# EAGLE design PCB_DIY_SQM_Test_RAW (EAGLE 6.2)
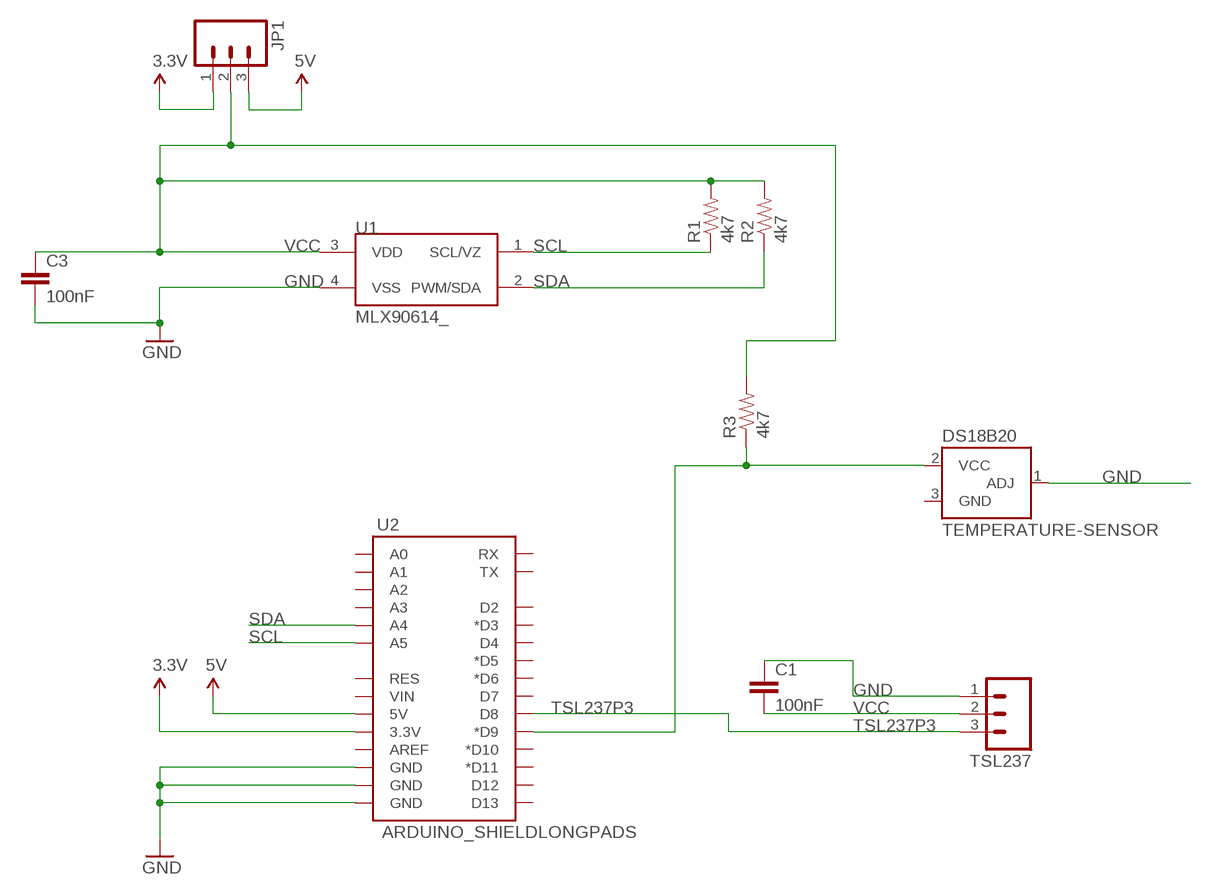
[diagram p0: schematic, sheet 1]

## Parts
C1  100nF  CAPPTH  [CAP-PTH-SMALL]
C3  100nF  CAPPTH  [CAP-PTH-SMALL]
DS18B20  TEMPERATURE-SENSOR  [TO-92]
JP1  M03LOCK_LONGPADS  [1X03_LOCK_LONGPADS]
R1  4k7  RESISTORPTH-1/4W  [AXIAL-0.4]
R2  4k7  RESISTORPTH-1/4W  [AXIAL-0.4]
R3  4k7  RESISTORPTH-1/4W  [AXIAL-0.4]
TSL237  M03LOCK_LONGPADS  [1X03_LOCK_LONGPADS]
U1  MLX90614_  [TO-39]
U2  ARDUINO_SHIELDLONGPADS  [DUEMILANOVE_SHIELD_LONGPADS]

## Nets
3.3V: JP1.1 U2.3.3V
5V: JP1.3 U2.5V
DS18B20P2: DS18B20.2(VCC) R3.P$1 U2.D9(*D9)
GND: C1.1 C3.2 DS18B20.1(ADJ) TSL237.1 U1.4(VSS) U2.GND@0(GND) U2.GND@1(GND) U2.GND@2(GND)
SCL: R1.P$1 U1.1(SCL/VZ) U2.A5
SDA: R2.P$1 U1.2(PWM/SDA) U2.A4
TSL237P3: TSL237.3 U2.D8
VCC: C1.2 C3.1 JP1.2 R1.P$2 R2.P$2 R3.P$2 TSL237.2 U1.3(VDD)
Unconnected: DS18B20.3(GND) U2.A0 U2.A1 U2.A2 U2.A3 U2.AREF U2.D2 U2.D3(*D3) U2.D4 U2.D5(*D5) U2.D6(*D6) U2.D7 U2.D10(*D10) U2.D11(*D11) U2.D12 U2.D13 U2.RES U2.RX U2.TX U2.VIN

## Library data of the parts
C1 C3 = SparkFun-Passives:CAP: Capacitor Standard 0603 ceramic capacitor, and 0.1" leaded capacitor.
DS18B20 = SparkFun-Sensors:TEMPERATURE-SENSOR: TO-92 temp sensor
JP1 TSL237 = SparkFun-Connectors:M03: Header 3 Standard 3-pin 0.1" header. Use with straight break away headers (SKU : PRT-00116), right angle break away headers (PRT-00553), swiss pins (PRT-00743), machine pins (PRT-00117), and female headers (PRT-00115). Molex polarized connector foot print use with SKU : PRT-08232 with associated crimp pins and housings.
R1-R3 = SparkFun-Passives:RESISTOR: Resistor Basic schematic elements and footprints for 0603, 1206, and PTH resistors.
U1 = SparkFun-Sensors:MLX90614: Non-contact PIR I2C interface temperature sensor
U2 = SparkFun-Boards:ARDUINO_SHIELD: Arduino shield footprint

## Board
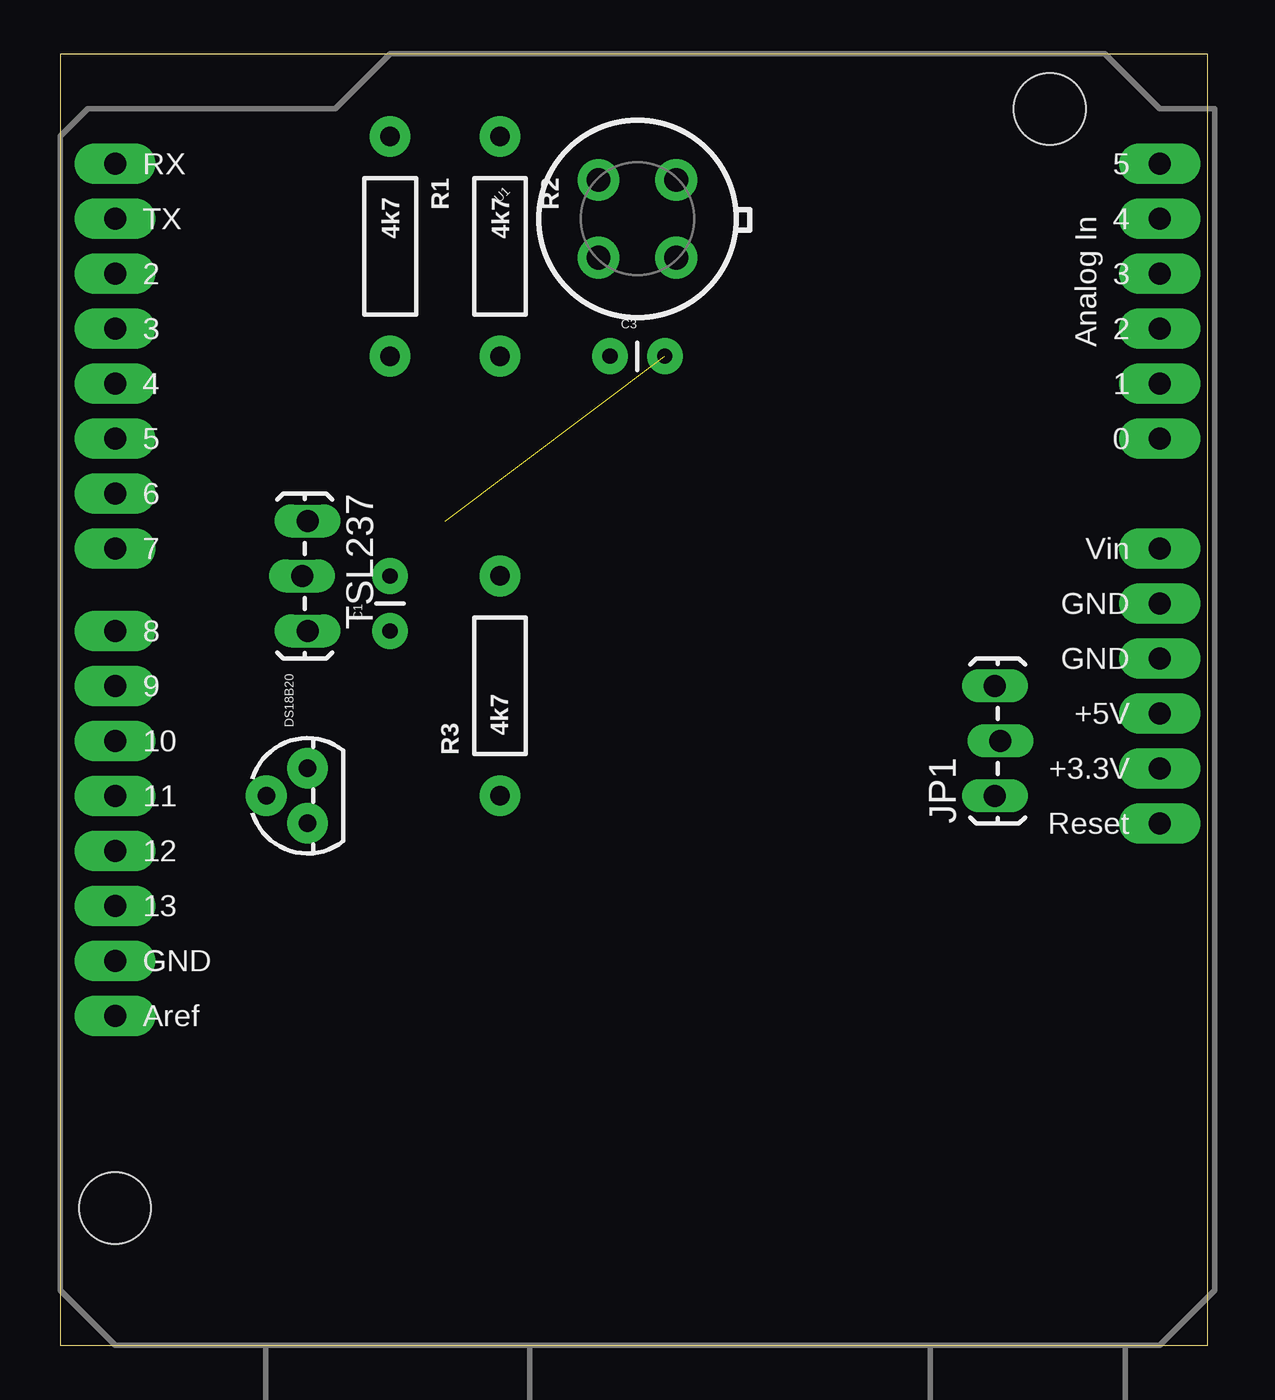
[diagram p1: board, top side]
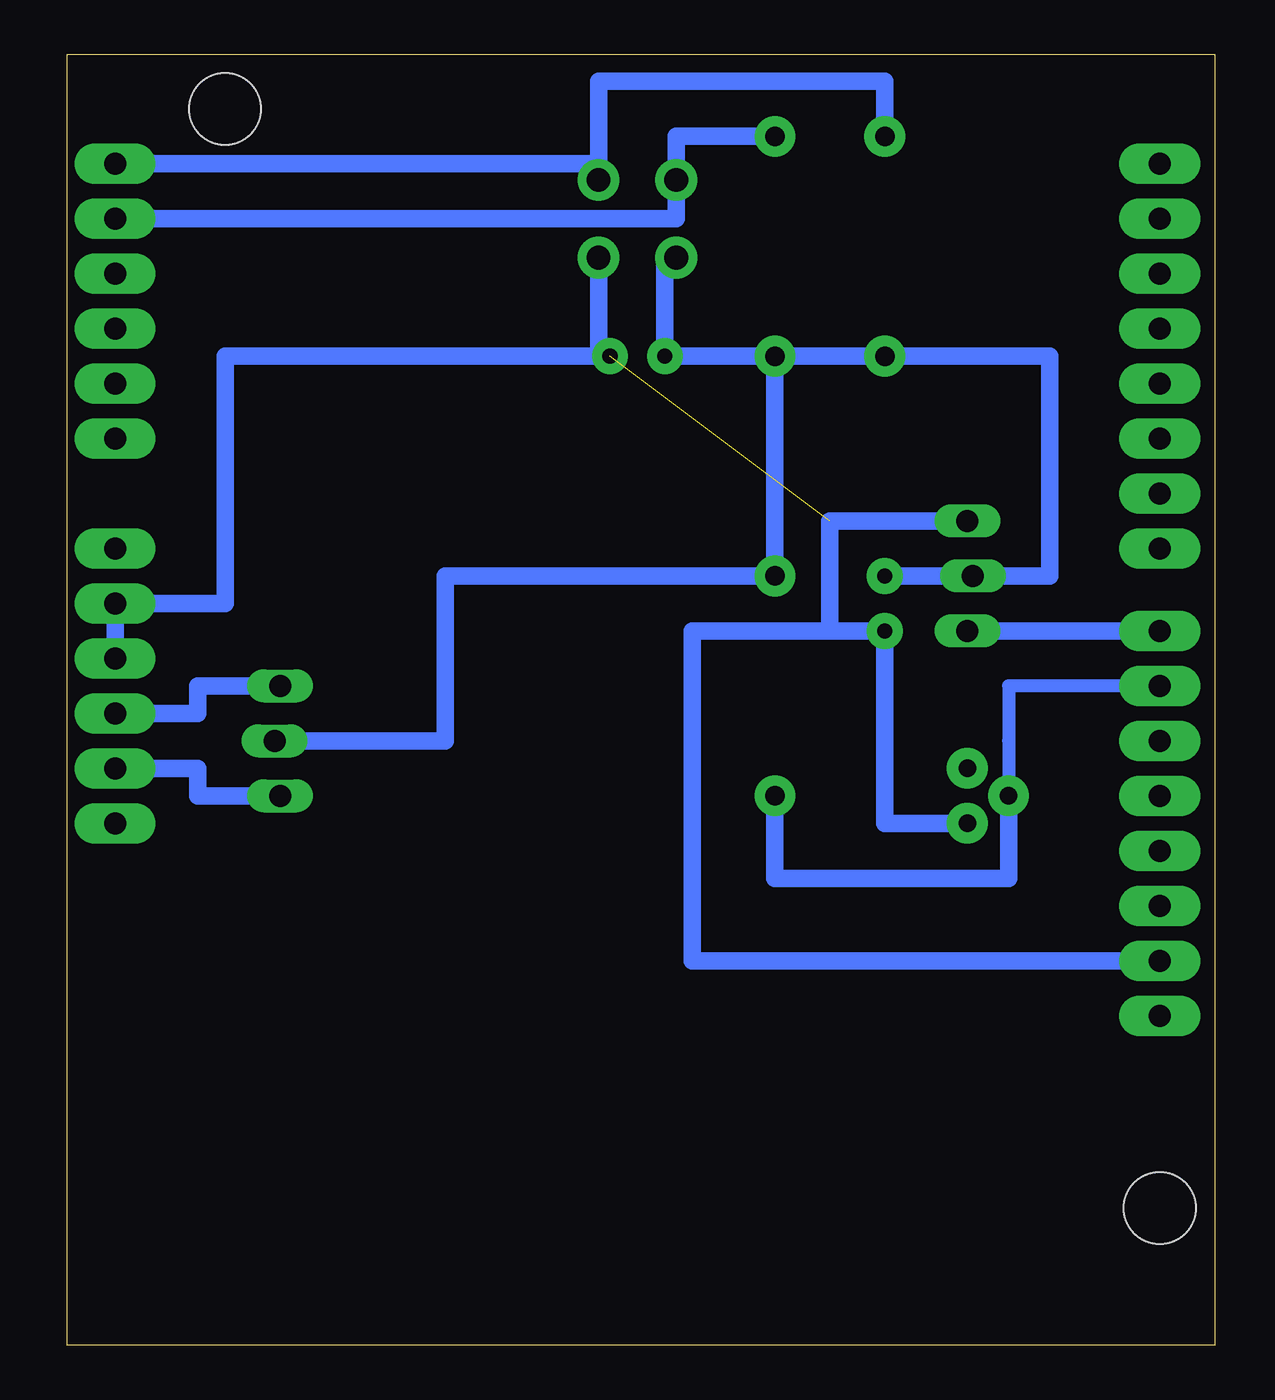
[diagram p2: board, bottom side, seen from below]

Size 53.01 x 59.68 mm. Coordinates in mm from the lower left corner, seen from the top.
Outline: 0,0 53.01,0 53.01,59.68 0,59.68 0,0
Copper layers (1*16): Top 0.035mm / dielectric 1.5mm / Bottom 0.035mm
Design rules: minimum track width 10mil, minimum drill 24mil, track to track 8mil, track to pad 8mil, pad to pad 8mil, via to via 8mil, smd to smd 8mil, copper to edge 40mil, drill to drill 8mil, minimum pad ring 10mil, minimum via ring 8mil, stop-mask expansion 4mil, vias tented up to drill 0mil, thermal gap 10mil

### Footprints (pad centres in the part's own frame; a part is rotated, then mirrored left to right if it is on the bottom)
CAP-PTH-SMALL = drill 0.7 pad 1.651: 1 0,0; 2 2.54,0
TO-92 = drill 0.813 pad 1.88: 1 -1.27,0; 2 0,1.905; 3 1.27,0
1X03_LOCK_LONGPADS = drill 1.016 long: 1 0,0; 2 2.54,-0.254; 3 5.08,0
AXIAL-0.4 = drill 0.9 pad 1.88: P$1 -5.08,0; P$2 5.08,0
TO-39 = drill 1.1 pad 1.93: 1 2.54,0; 2 0,2.54; 3 -2.54,0; 4 0,-2.54
DUEMILANOVE_SHIELD_LONGPADS = drill 1.016 pad 1.88 long: 3.3V 50.8,26.67; 5V 50.8,29.21; A0 50.8,41.91; A1 50.8,44.45; A2 50.8,46.99; A3 50.8,49.53; A4 50.8,52.07; A5 50.8,54.61; AREF 2.54,15.24; D2 2.54,49.53; D3 2.54,46.99; D4 2.54,44.45; D5 2.54,41.91; D6 2.54,39.37; D7 2.54,36.83; D8 2.54,33.02; D9 2.54,30.48; D10 2.54,27.94; D11 2.54,25.4; D12 2.54,22.86; D13 2.54,20.32; GND@0 50.8,31.75; GND@1 50.8,34.29; GND@2 2.54,17.78; RES 50.8,24.13; RX 2.54,54.61; TX 2.54,52.07; VIN 50.8,36.83 | hole 3.302: 45.72,57.15; 2.54,6.35

### Placement (x,y rotation side)
C1  15.24,33.02 90 top
C3  25.4,45.72 0 top
DS18B20  11.43,25.4 90 top
JP1  43.18,25.4 90 top
R1  15.24,50.8 270 top
R2  20.32,50.8 270 top
R3  20.32,30.48 90 top
TSL237  11.43,38.1 270 top
U1  26.67,52.07 45 top
U2  0,0 0 top

### Tracks (layer width: path | path; a pad name or v marks a point on that pad's centre or on a via)
3.3V
  Bottom 0.813: U2.3.3V 46.99,26.67 46.99,25.4 JP1.1
5V
  Bottom 0.813: U2.5V 46.99,29.21 46.99,30.48 JP1.3
DS18B20P2
  Bottom 0.61: 9.53,27.94 DS18B20.2 9.53,30.48 U2.D9
  Bottom 0.813: R3.P$1 20.32,21.59 9.53,21.59 DS18B20.2
GND  (1 unrouted)
  Bottom 0.813: U1.4 28.47,45.72 C3.2 45.72,45.72 45.72,34.29 U2.GND@1 U2.GND@0 | DS18B20.1 15.24,24.13 C1.1 17.78,33.02 | TSL237.1 17.78,38.1 17.78,33.02 | U2.GND@2 24.13,17.78 24.13,33.02 17.78,33.02
SCL
  Bottom 0.813: U2.A5 28.47,54.61 | 28.47,54.61 U1.1 | R1.P$1 15.24,58.42 28.47,58.42 28.47,54.61
SDA
  Bottom 0.813: U2.A4 24.87,52.07 U1.2 24.87,55.88 R2.P$1
TSL237P3
  Bottom 0.813: TSL237.3 U2.D8
VCC
  Bottom 0.813: R2.P$2 R1.P$2 7.62,45.72 7.62,35.56 C1.2 TSL237.2 | R2.P$2 R3.P$2 35.56,35.56 35.56,27.94 JP1.2 | U1.3 25.4,50.27 C3.1 R2.P$2